# Altium project PCB_Project.PrjPcb
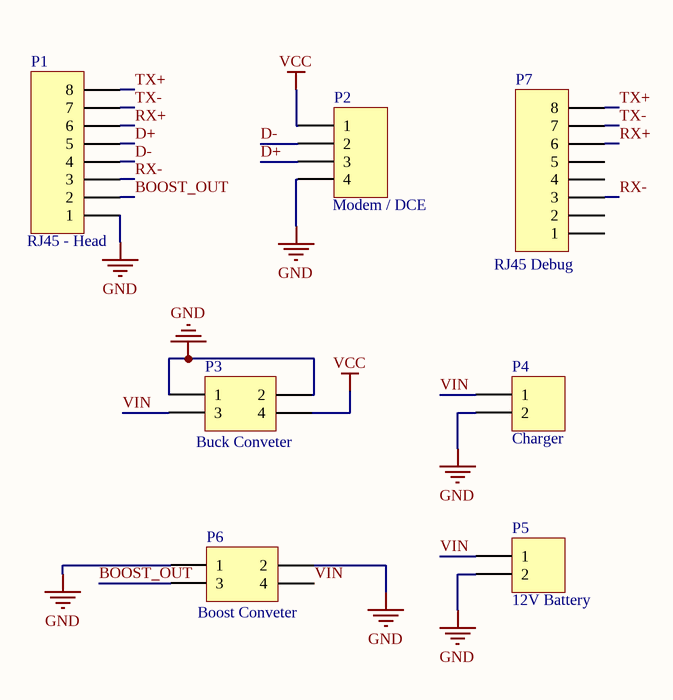
[diagram p0: TailBoard.SchDoc]
1 sheet, 7 parts. Net scope: global (net labels, ports and power ports of the same name join across sheets).
Board file: TailBoard.PcbDoc

## Sheet TailBoard.SchDoc
size A; PageSetup: Record=PageOptions|CenterHorizontal=True|CenterVertical=True|PrintScale=2.04|XCorrection=1.00|YCorrection=1.00|PrintKind=0|BorderSize=5000000|LeftOffset=0|BottomOffset=0|Orientation=1|PaperLength=1000|PaperWidth=1000|Scale=100|PaperSource=7|PrintQuality=-3|MediaType=1|DitherType=10|PrintScaleMode=1|PaperKind=B5 (JIS)|PaperIndex=13

### Parts
P1  RJ45 - Head  [RJ45]
P2  Modem / DCE  [USB_Female]
P3  Buck Conveter  [PWR_HEADER]
P4  Charger  [PWR_HEADER - duplicate]
P5  12V Battery  [PWR_HEADER - duplicate]
P6  Boost Conveter  [PWR_HEADER]
P7  RJ45 Debug  [RJ45]

### Nets
GND: P1.1 P2.4 P3.1 P3.2 P4.2 P5.2 P6.1 P6.2
VCC: P2.1 P3.4
BOOST_OUT: P1.2 P6.3
D+: P1.5 P2.3
D-: P1.4 P2.2
RX+: P1.6 P7.6
RX-: P1.3 P7.3
TX+: P1.8 P7.8
TX-: P1.7 P7.7
VIN: P3.3 P4.1 P5.1 P6.4

Not connected (* = marked no-connect by the designer): P7 1 2 4 5

### Library data of the parts
P1 P7 = Header 8: Header, 8-Pin; LatestRevisionDate: 17-Jul-2002; LatestRevisionNote: Re-released for DXP Platform.; Publisher: Altium Limited
P2 = Header 4: Header, 4-Pin; LatestRevisionDate: 17-Jul-2002; LatestRevisionNote: Re-released for DXP Platform.; Publisher: Altium Limited
P3 P6 = Header 2X2: Header, 2-Pin, Dual row; LatestRevisionDate: 17-Jul-2002; LatestRevisionNote: Re-released for DXP Platform.; Publisher: Altium Limited
P4 P5 = Header 2: Header, 2-Pin; LatestRevisionDate: 17-Jul-2002; LatestRevisionNote: Re-released for DXP Platform.; Publisher: Altium Limited